# EAGLE design E32-433T30D (EAGLE 7.6.0)
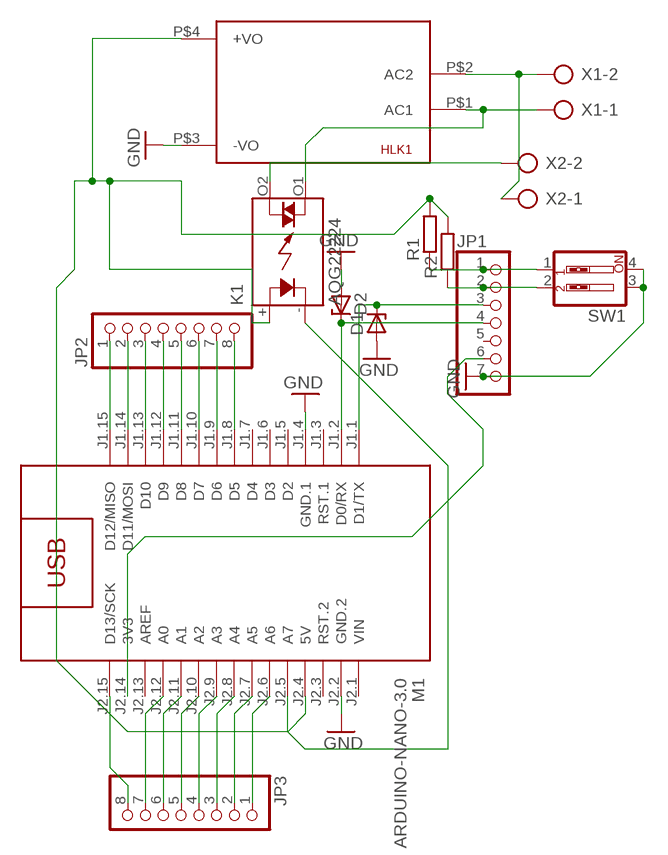
[diagram p0: schematic, sheet 1]

## Parts
D1  ZENER-DIODEDO35Z10  [DO35Z10]
D2  ZENER-DIODEDO35Z10  [DO35Z10]
HLK1  HLK-PM013W  [HLK-PM01]
JP1  PINHD-1X7  [1X07]
JP2  PINHD-1X8  [1X08]
JP3  PINHD-1X8  [1X08]
K1  AQG22224  [AQG]
M1  ARDUINO-NANO-3.0  [ARDUINO-NANO-3.0]
R1  R-EU_0204/7  [0204/7]
R2  R-EU_0204/7  [0204/7]
SW1  SW_DIP-2  [EDG-02]
X1  AK300/2  [AK300/2]
X2  AK300/2  [AK300/2]

## Nets
3.3V: JP1.6 M1.J2.14(3V3)
5V: HLK1.P$4(+VO) K1.+(A) M1.J2.4(5V) R1.2 R2.2
GND: D1.A D2.A HLK1.P$3(-VO) JP1.7 M1.J1.4(GND.1) M1.J2.2(GND.2) SW1.3 SW1.4
N$1: JP3.7 M1.J2.12(A0)
N$2: D2.C JP1.4 M1.J1.2(D0/RX)
N$3: K1.-(K) M1.J2.5(A7)
N$4: JP1.2 R2.1 SW1.2
N$5: JP1.1 R1.1 SW1.1
N$6: HLK1.P$1(AC1) K1.O1(DS2) X1.1
N$7: HLK1.P$2(AC2) X1.2 X2.1
N$8: JP2.8 M1.J1.8(D5)
N$9: JP2.7 M1.J1.9(D6)
N$10: JP2.6 M1.J1.10(D7)
N$11: JP2.5 M1.J1.11(D8)
N$12: JP2.4 M1.J1.12(D9)
N$13: JP2.3 M1.J1.13(D10)
N$14: JP2.2 M1.J1.14(D11/MOSI)
N$15: JP2.1 M1.J1.15(D12/MISO)
N$16: JP3.8 M1.J2.15(D13/SCK)
N$17: JP3.6 M1.J2.11(A1)
N$18: JP3.5 M1.J2.10(A2)
N$19: JP3.4 M1.J2.9(A3)
N$20: D1.C JP1.3 M1.J1.1(D1/TX)
N$21: JP3.3 M1.J2.8(A4)
N$22: JP3.2 M1.J2.7(A5)
N$23: JP3.1 M1.J2.6(A6)
N$24: K1.O2(DS1) X2.2
Unconnected: JP1.5 M1.J1.3(RST.1) M1.J1.5(D2) M1.J1.6(D3) M1.J1.7(D4) M1.J2.3(RST.2) M1.J2.13(AREF)

## Power pins joined to a net without a drawn wire
VIN: M1.J2.1(VIN)

## Library data of the parts
D1 D2 = diode:ZENER-DIODE: Z-Diode
HLK1 = HLK-PM01:HLK-PM01: Hi-Link Power Supply HLK-PM01 3W Author: Ahmed Said <https://github.com/AhmedSaid/EAGLELibraries>
JP1 = pinhead:PINHD-1X7: PIN HEADER
JP2 JP3 = pinhead:PINHD-1X8: PIN HEADER
K1 = relay:AQG*: SOLID STATE RELAY NAiS Zero-cross, Non zero-cross Source: http://www.mew-europe.com/.. en_ds_61611_0000.pdf; MPN: AQG22224; OC_FARNELL: unknown; OC_NEWARK: 11N2589
M1 = diy-modules:ARDUINO-NANO-3.0: Arduino Nano 3.0 and compatible devices More details available here: https://www.arduino.cc/en/Main/ArduinoBoardNano Click here to find device on ebay.com <http://www.ebay.com/sch/arduino+nano>
R1 R2 = rcl:R-EU_: RESISTOR, European symbol
SW1 = special:SW_DIP-2: DIP SWITCH
X1 X2 = con-ptr500:AK300/2: CONNECTOR; OC_FARNELL: unknown; OC_NEWARK: unknown

## Board
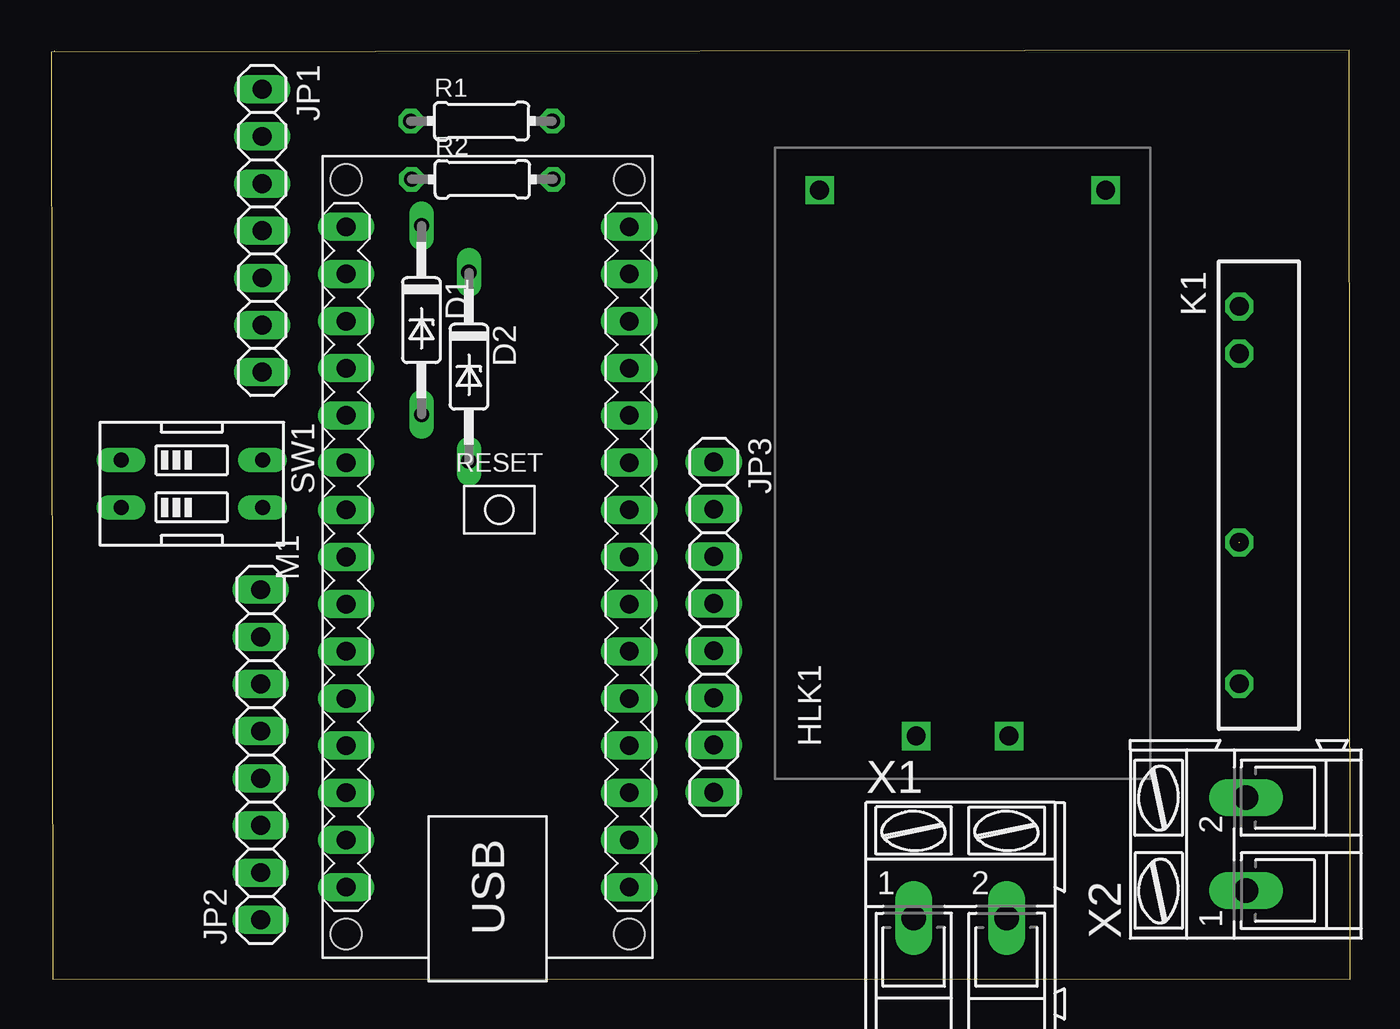
[diagram p1: board, top side]
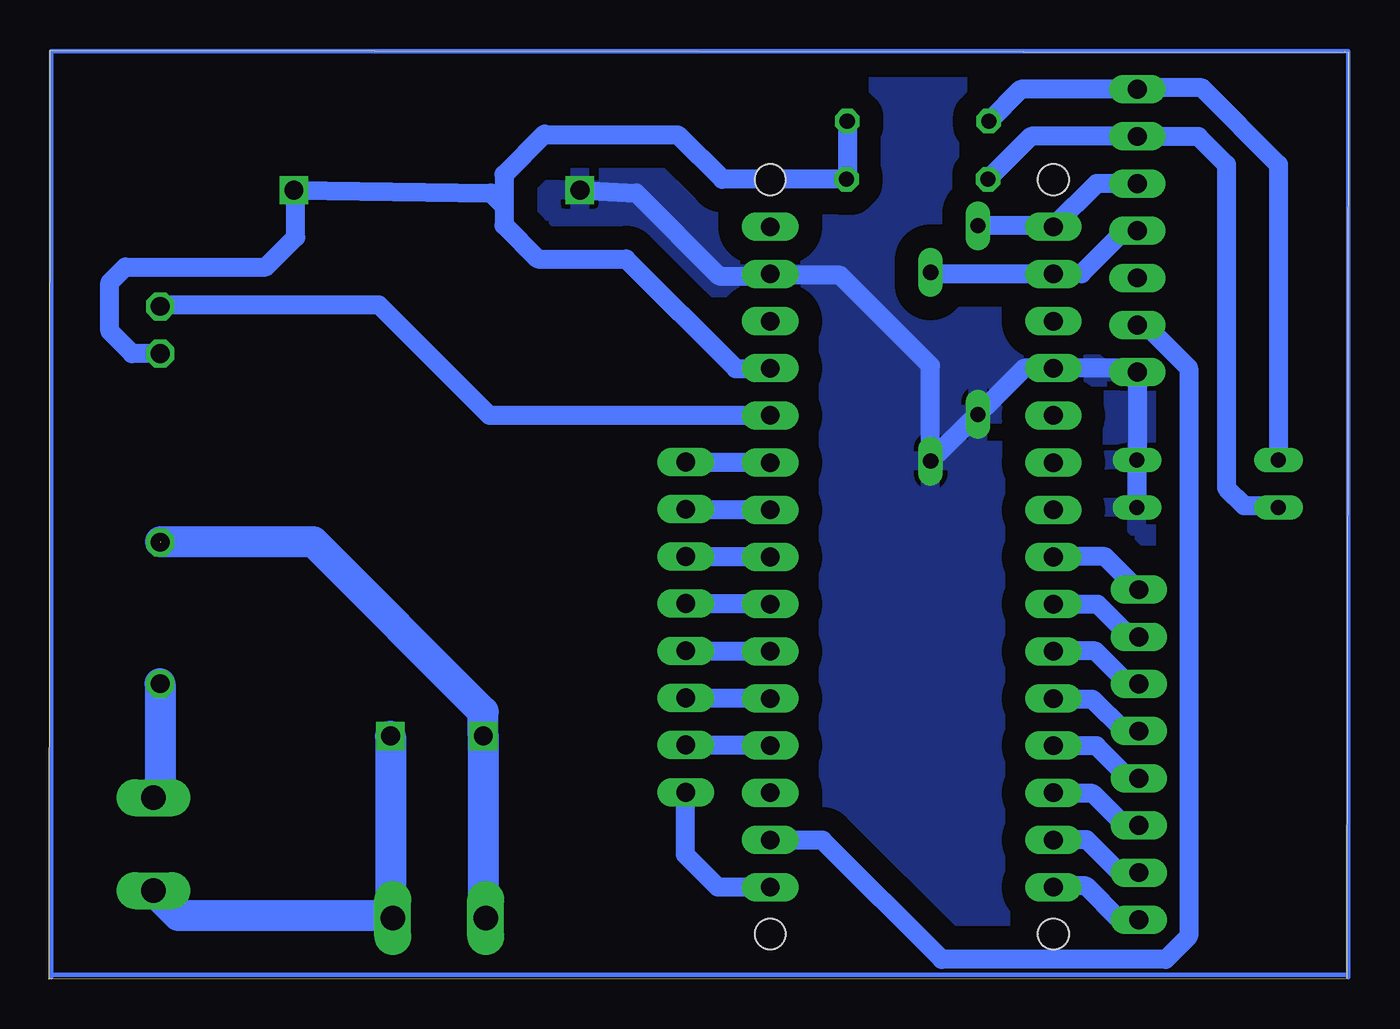
[diagram p2: board, bottom side, seen from below]

Size 69.97 x 50.03 mm. Coordinates in mm from the lower left corner, seen from the top.
Outline: 0.09,0.03 69.97,0 69.9,50.03 0,49.94 0.09,0.03
Copper layers (1*16): Top 0.035mm / dielectric 1.5mm / Bottom 0.035mm
Design rules "default": minimum track width 10mil, minimum drill 24mil, track to track 8mil, track to pad 8mil, pad to pad 8mil, via to via 8mil, smd to smd 8mil, copper to edge 40mil, drill to drill 8mil, minimum pad ring 10mil, minimum via ring 8mil, stop-mask expansion 4mil, vias tented up to drill 0mil, thermal gap 10mil

### Footprints (pad centres in the part's own frame; a part is rotated, then mirrored left to right if it is on the bottom)
DO35Z10 = drill 0.813 long: A 5.08,0; C -5.08,0
HLK-PM01 = drill 1.016 square: P$1 -14.7,2.5; P$2 -14.7,-2.5; P$3 14.7,7.7; P$4 14.7,-7.7
1X07 = drill 1.016 long: 1 -7.62,0; 2 -5.08,0; 3 -2.54,0; 4 0,0; 5 2.54,0; 6 5.08,0; 7 7.62,0
1X08 = drill 1.016 long: 1 -8.89,0; 2 -6.35,0; 3 -3.81,0; 4 -1.27,0; 5 1.27,0; 6 3.81,0; 7 6.35,0; 8 8.89,0
AQG = drill 1 octagon: + -7.62,0; - -10.16,0; O1 2.54,0; O2 10.16,0
ARDUINO-NANO-3.0 = drill 1 pad 1.524 long: J1.1 17.78,7.62; J1.2 15.24,7.62; J1.3 12.7,7.62; J1.4 10.16,7.62; J1.5 7.62,7.62; J1.6 5.08,7.62; J1.7 2.54,7.62; J1.8 0,7.62; J1.9 -2.54,7.62; J1.10 -5.08,7.62; J1.11 -7.62,7.62; J1.12 -10.16,7.62; J1.13 -12.7,7.62; J1.14 -15.24,7.62; J1.15 -17.78,7.62; J2.1 17.78,-7.62; J2.2 15.24,-7.62; J2.3 12.7,-7.62; J2.4 10.16,-7.62; J2.5 7.62,-7.62; J2.6 5.08,-7.62; J2.7 2.54,-7.62; J2.8 0,-7.62; J2.9 -2.54,-7.62; J2.10 -5.08,-7.62; J2.11 -7.62,-7.62; J2.12 -10.16,-7.62; J2.13 -12.7,-7.62; J2.14 -15.24,-7.62; J2.15 -17.78,-7.62 | hole 1.651: -20.32,7.62; -20.32,-7.62; 20.32,-7.62; 20.32,7.62
0204/7 = drill 0.813 octagon: 1 -3.81,0; 2 3.81,0
EDG-02 = drill 0.813 long: 1 -1.27,-3.81; 2 1.27,-3.81; 3 1.27,3.81; 4 -1.27,3.81
AK300/2 = drill 1.321 long: 1 -2.515,0; 2 2.489,0

### Placement (x,y rotation side)
D1  19.94,35.5 270 top
D2  22.5,32.99 270 top
HLK1  49.09,27.8 90 top
JP1  11.37,40.31 270 top
JP2  11.29,12.09 90 top
JP3  35.69,18.96 270 top
K1  63.99,26.07 270 top
M1  23.51,22.74 90 top
R1  23.18,46.22 0 top
R2  23.22,43.08 0 top
SW1  7.58,26.69 270 top
X1  48.97,3.3 0 top
X2  64.34,7.28 90 top

### Tracks (layer width: path | path; a pad name or v marks a point on that pad's centre or on a via)
3.3V
  Bottom 1.016: JP1.6 10.9,35.23 8.6,32.93 8.6,2.32 9.85,1.07 21.9,1.07 28.32,7.49 31.12,7.49 M1.J2.14
5V
  Bottom 1.016: 45.47,41.64 45.47,43.34 43.28,45.53 43.22,45.47 36.11,45.47 33.72,43.08 R2.2 26.99,43.12 R1.2 | 45.47,41.64 45.47,40.61 43.66,38.8 38.9,38.8 32.99,32.89 31.15,32.89 M1.J2.4 | 45.47,41.64 46.17,42.34 HLK1.P$4 56.69,42.4 56.69,39.97 58.3,38.36 65.86,38.36 66.7,37.53 66.7,34.9 65.5,33.69 K1.+
GND
  Bottom 1.016: HLK1.P$3 38.35,42.34 33.89,37.88 31.63,37.88 | 31.63,37.88 31.23,37.88 M1.J2.2 | SW1.3 SW1.4 11.37,27.97 JP1.7 11.58,32.9 M1.J1.4 17.46,32.9 D1.A 19.99,30.42 D2.A 22.5,33.05 27.37,37.92 31.59,37.92 31.63,37.88
  pour Bottom (isolate 1.27): 0,50.08 69.93,50.08 69.93,-0.44 -0.1,-0.44 -0.1,49.98
N$1
  Bottom 1.016: JP3.7 31.16,12.61 M1.J2.12
N$2
  Bottom 1.016: 16.39,37.98 M1.J1.2 14.38,37.99 12.06,40.31 JP1.4 | 16.39,37.98 22.41,37.98 D2.C | 16.32,37.92 16.39,37.98
N$3
  Bottom 1.016: M1.J2.5 46.26,30.36 52.2,36.31 63.91,36.31 K1.-
N$4
  Bottom 1.016: 19.33,43 R2.1 17.1,45.39 JP1.2 8.08,45.38 6.58,43.88 6.58,26.46 5.61,25.5 3.85,25.5 SW1.2
N$5
  Bottom 1.016: SW1.1 3.77,43.88 7.89,48 11.3,48 JP1.1 17.65,47.93 R1.1
N$6  (1 unrouted)
  Bottom 1.676: X1.1 46.59,3.43 HLK1.P$1 46.59,14.41 55.73,23.55 63.97,23.55
N$7
  Bottom 1.676: HLK1.P$2 51.59,3.43 | 51.59,3.43 X1.2 | 51.59,3.43 63,3.43 X2.1
N$8
  Bottom 1.016: JP2.8 11.33,20.98 13.12,22.77 15.87,22.77 M1.J1.8
N$9
  Bottom 1.016: JP2.7 11.76,18.44 13.5,20.19 15.88,20.19 M1.J1.9
N$10
  Bottom 1.016: JP2.6 11.84,15.9 13.62,17.68 15.87,17.68 M1.J1.10
N$11
  Bottom 1.016: JP2.5 12.08,13.36 13.8,15.08 15.85,15.08 M1.J1.11
N$12
  Bottom 1.016: JP2.4 11.82,10.82 13.57,12.58 M1.J1.12
N$13
  Bottom 1.016: JP2.3 12.04,8.28 13.77,10 15.85,10 M1.J1.13
N$14
  Bottom 1.016: JP2.2 12.32,5.74 14.09,7.52 15.88,7.52 M1.J1.14
N$15
  Bottom 1.016: JP2.1 12.3,3.2 14.12,5.02 15.83,5.02 M1.J1.15
N$16
  Bottom 1.016: M1.J2.15 33.96,4.96 35.7,6.7 35.7,10.06 JP3.8
N$17
  Bottom 1.016: M1.J2.11 35.66,15.12 JP3.6
N$18
  Bottom 1.016: JP3.5 31.16,17.69 M1.J2.10
N$19
  Bottom 1.016: M1.J2.9 35.66,20.2 JP3.4
N$20
  Bottom 1.016: 16.46,40.58 15.94,40.58 M1.J1.1 13.56,42.85 JP1.3 | 16.46,40.58 D1.C | 16.34,40.46 16.46,40.58
N$21
  Bottom 1.016: JP3.3 31.16,22.77 M1.J2.8
N$22
  Bottom 1.016: M1.J2.7 35.66,25.28 JP3.2
N$23
  Bottom 1.016: JP3.1 31.16,27.85 M1.J2.6
N$24
  Bottom 1.676: K1.O2 63.99,10.13 X2.2
N$25  (1 unrouted)
  Bottom 0.254: 0.17,49.98 69.84,49.98 69.84,0.1 | 0.01,0.1 0.01,49.98 0.2,49.98 0.2,49.97
N$26
  Bottom 0.254: 0.1,0.25 69.86,0.25 69.86,0.13